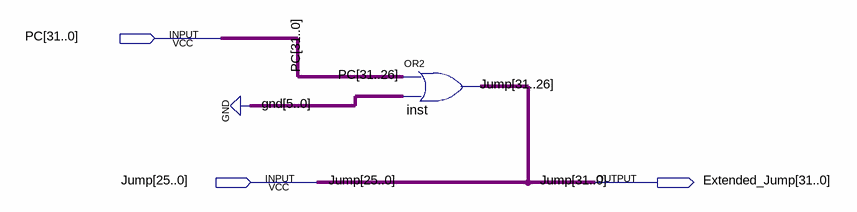
[diagram p0: schematic sheet]
// Quartus schematic extend_jump.bdf as structural Verilog: 1 symbols, 3 pins
module extend_jump (
  input  [31:0] PC,
  input  [25:0] Jump,
  output [31:0] Extended_Jump
);

  assign Extended_Jump[31:26] = PC[31:26] | {6{1'b0}};  // OR2 inst, 6 bits wide

  assign Extended_Jump[25:0] = Jump;

  // Other names for the same wires on the sheet: Jump[31:26] = Extended_Jump[31:26]
endmodule
